# EAGLE schematic Dispenser (EAGLE 7.3.0)
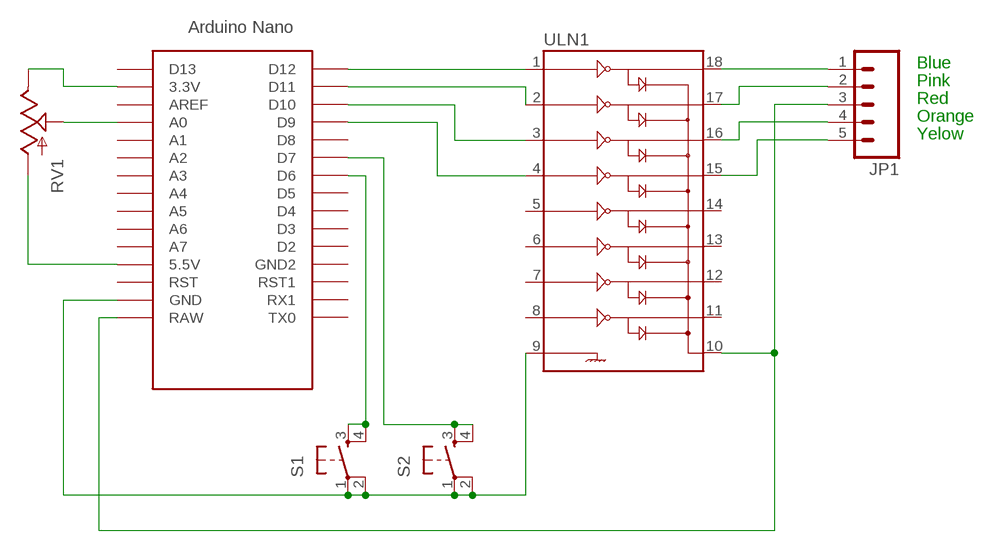
[diagram p0: schematic, sheet 1]

## Parts
JP1  M05LOCK  [1X05_LOCK]
RV1  POT  [ALPS_POT]
S1  TAC_SWITCHPTH  [TACTILE-PTH]
S2  TAC_SWITCHPTH  [TACTILE-PTH]
U$1  NANO  [NANO]
ULN1  ULN2803DIP  [DIL18]

## Nets
N$1: U$1.D12 ULN1.1
N$2: U$1.D11 ULN1.2
N$3: U$1.D10 ULN1.3
N$4: U$1.D9 ULN1.4
N$5: S1.3 S1.4 U$1.D6
N$6: S2.3 S2.4 U$1.D7
N$7: S1.1 S1.2 S2.1 S2.2 U$1.GND ULN1.9
N$8: RV1.P$3(A) U$1.5V(5.5V)
N$9: JP1.1 ULN1.18
N$10: JP1.2 ULN1.17
N$11: JP1.4 ULN1.16
N$12: JP1.5 ULN1.15
N$13: RV1.P$1(E) U$1.3.3V
N$14: RV1.P$2(S) U$1.A0
N$16: JP1.3 U$1.RAW ULN1.10
Unconnected: U$1.A1 U$1.A2 U$1.A3 U$1.A4 U$1.A5 U$1.A6 U$1.A7 U$1.AREF U$1.D2 U$1.D3 U$1.D4 U$1.D5 U$1.D8 U$1.D13 U$1.GND1(GND2) U$1.ICSP1 U$1.ICSP2 U$1.ICSP3 U$1.ICSP4 U$1.ICSP5 U$1.ICSP6 U$1.RST U$1.RST1 U$1.RX1 U$1.TX0 ULN1.5 ULN1.6 ULN1.7 ULN1.8 ULN1.11 ULN1.12 ULN1.13 ULN1.14

## Notes on the sheet
- Blue
- Pink
- Red
- Orange
- Yelow

## Library data of the parts
JP1 = SparkFun-Connectors:M05: Header 5 Standard 5-pin 0.1" header. Use with straight break away headers (SKU : PRT-00116), right angle break away headers (PRT-00553), swiss pins (PRT-00743), machine pins (PRT-00117), and female headers (PRT-00115). Molex polarized connector foot print use with SKU : PRT-08230 with associated crimp pins and housings.
RV1 = SparkFun-Electromechanical:POT; PROD_ID: RES-09177
S1 S2 = SparkFun-Retired:TAC_SWITCH: Momentary Switch Button commonly used for reset or general input. Spark Fun Electronics SKU : COM-00097 SMT- SWCH-08247
U$1 = Arduino-clone:NANO: Arduino Nano
ULN1 = SparkFun-PowerIC:ULN2803: Darlington Driver ULN2803 Darlington array. 500mA max per channel, 8-channel package. Spark Fun Electronics SKU : COM-00312